# EAGLE schematic pic_k42 (EAGLE 9.6.2)
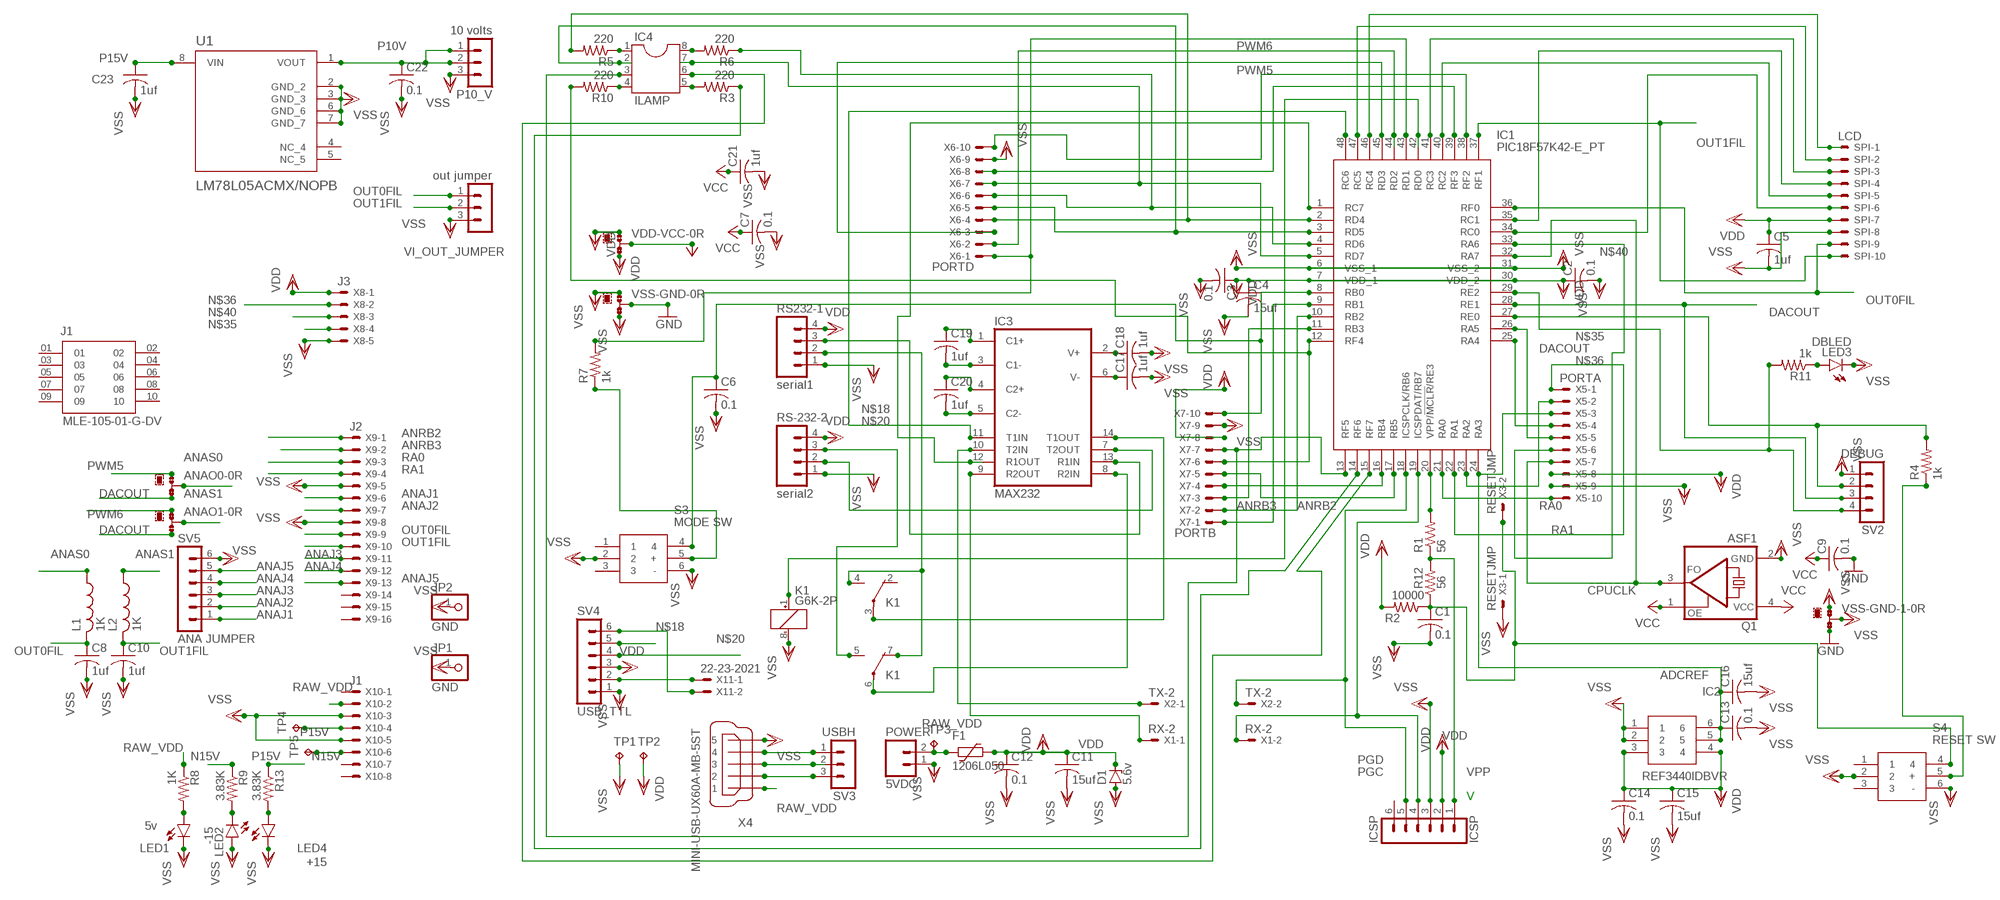
[diagram p0: schematic, sheet 1]

## Parts
ANAO0  PS V  0R-JUMPA  [A0R-JMP]
ANAO1  PS I  0R-JUMPA  [A0R-JMP]
C1  0.1  C-USC1206  [C1206]
C2  0.1  C-USC1206  [C1206]
C3  0.1  C-USC1206  [C1206]
C4  15uf  C-USC1206  [C1206]
C5  1uf  C-USC0805  [C0805]
C6  0.1  C-USC1206  [C1206]
C7  0.1  C-USC1206  [C1206]
C8  1uf  C-USC0805  [C0805]
C9  0.1  C-USC1206  [C1206]
C10  1uf  C-USC0805  [C0805]
C11  15uf  C-USC1206  [C1206]
C12  0.1  C-USC1206  [C1206]
C13  0.1  C-USC1206  [C1206]
C14  0.1  C-USC1206  [C1206]
C15  15uf  C-USC1206  [C1206]
C16  15uf  C-USC1206  [C1206]
C17  1uf  C-USC0805  [C0805]
C18  1uf  C-USC0805  [C0805]
C19  1uf  C-USC0805  [C0805]
C20  1uf  C-USC0805  [C0805]
C21  1uf  C-USC0805  [C0805]
C22  0.1  C-USC1206  [C1206]
C23  1uf  C-USC0805  [C0805]
D1  5.6v  ZENER-DIODEDO34-7  [DO34Z7]
F1  1206L050  [1206L]
IC1  PIC18F57K42-E_PT  [QFP50P900X900X120-48N]
IC2  REF3440IDBVR  [SOP95P280X145-6N]
IC3  MAX232  [DIL16]
IC4  ILAMP  DIL8S  [SOCKET-08]
ICSP  ICSP  MA06-1  [MA06-1]
J1  MLE-105-01-G-DV  [SAMTEC_MLE-105-01-G-DV]
JP1  GND  PINHD-1X1  [1X01]
JP2  GND  PINHD-1X1  [1X01]
K1  G6K-2P  [G6K-2P]
L1  1K  L-USL2012C  [L2012C]
L2  1K  L-USL2012C  [L2012C]
LED1  5v  LEDCHIPLED_1206  [CHIPLED_1206]
LED2  -15  LEDCHIPLED_1206  [CHIPLED_1206]
LED3  DBLED  LEDCHIPLED_1206  [CHIPLED_1206]
LED4  +15  LEDCHIPLED_1206  [CHIPLED_1206]
P10_V  10 volts  MA03-1  [MA03-1]
POWER  5VDC  M02  [02P]
Q1  ASF1  [ASF]
R1  56  R-US_R1206  [R1206]
R2  10000  R-US_R1206  [R1206]
R3  220  R-US_R1206  [R1206]
R4  1k  R-US_R1206  [R1206]
R5  220  R-US_R1206  [R1206]
R6  220  R-US_R1206  [R1206]
R7  1k  R-US_R1206  [R1206]
R8  1K  R-US_R1206  [R1206]
R9  3.83K  R-US_R1206  [R1206]
R10  220  R-US_R1206  [R1206]
R11  1k  R-US_R1206  [R1206]
R12  56  R-US_R1206  [R1206]
R13  3.83K  R-US_R1206  [R1206]
RS232-1  serial1  M04  [04P]
RS-232-2  serial2  M04  [04P]
S3  MODE SW  B3W-9000-Y1N  [B3W-9_1-LED]
S4  RESET SW  B3W-9000-Y1N  [B3W-9_1-LED]
SPI  LCD  22-23-2101  [22-23-2101]
SV2  DEBUG  MA04-1  [MA04-1]
SV3  USBH  MA03-1  [MA03-1]
SV4  USB_TTL  MA06-1  [MA06-1]
SV5  ANA JUMPER  MA06-1  [MA06-1]
TP1  TPB1,27  [B1,27]
TP2  TPB1,27  [B1,27]
TP3  TPB1,27  [B1,27]
TP4  TPB1,27  [B1,27]
TP5  TPB1,27  [B1,27]
U1  LM78L05ACMX/NOPB  [SOIC127P599X175-8N]
VDD-VCC  VDD-VCC  0R-JUMPA  [A0R-JMP]
VI_OUT_JUMPER  out jumper  MA03-1  [MA03-1]
VSS-GND  VSS-GND  0R-JUMPA  [A0R-JMP]
VSS-GND-1  0R-JUMPA  [A0R-JMP]
X1  RX-2  332-02  [332-02]
X2  TX-2  332-02  [332-02]
X3  RESETJMP  332-02  [332-02]
X4  MINI-USB-UX60A-MB-5ST  [UX60A-MB-5ST]
X5  PORTA  22-23-2101  [22-23-2101]
X6  PORTD  22-23-2101  [22-23-2101]
X7  PORTB  22-23-2101  [22-23-2101]
X8  J3  KK-156-5  [KK-156-5]
X9  J2  KK-156-16  [KK-156-16]
X10  J1  KK-156-8  [KK-156-8]
X11  22-23-2021  [22-23-2021]

## Nets
ADCREF: C13.1 C16.1 IC1.24(RA3) IC2.5 IC2.6 X5.3
ANAJ1: SV5.1 X9.6
ANAJ2: SV5.2 X9.7
ANAJ3: SV5.3 X9.11
ANAJ4: SV5.4 X9.12
ANAJ5: SV5.5 X9.13
ANAS0: ANAO0.2 L1.1
ANAS1: ANAO1.2 L2.1
ANRB2: IC1.10(RB2) X7.2 X9.1
ANRB3: IC1.11(RB3) X7.3 X9.2
CPUCLK: IC1.32(RA7) Q1.3(FO) X5.7
DACOUT: ANAO0.3 ANAO1.3 IC1.23(RA2) IC1.28(RE1) SV2.3 X5.2
GND: C9.2 VSS-GND-1.3 VSS-GND.2
N15V: R9.1 TP5.TP X10.6
N$2: IC1.20(VPP/!MCLR!/RE3) R1.2
N$3: IC4.1 R5.1
N$5: C17.1 IC3.6(V-)
N$9: C18.1 IC3.2(V+)
N$10: C19.1 IC3.1(C1+)
N$11: C20.1 IC3.4(C2+)
N$12: C20.2 IC3.5(C2-)
N$13: C19.2 IC3.3(C1-)
N$14: K1.4(2:S) K1.7(3:O) RS232-1.2
N$15: IC3.7(T2OUT) RS-232-2.2
N$16: IC3.13(R1IN) RS232-1.3
N$17: IC4.8 R6.2
N$18: IC1.1(RC7) IC3.12(R1OUT) SV4.5
N$19: IC3.9(R2OUT) X1.1
N$20: IC1.48(RC6) IC3.11(T1IN) SV4.4
N$21: R4.1 S4.5(+)
N$22: IC3.10(T2IN) X2.1
N$23: IC1.27(RE0) R4.2 SV2.2
N$25: IC1.29(RE2) R11.2 SV2.4
N$26: IC3.14(T1OUT) K1.3(2:P)
N$27: IC3.8(R2IN) K1.6(3:P)
N$28: IC1.42(RD0) K1.1(1:+)
N$29: IC1.46(RC4) SPI.1
N$30: IC1.47(RC5) SPI.2
N$31: IC1.41(RC3) SPI.3
N$32: IC1.35(RC1) SPI.4
N$33: IC1.40(RC2) SPI.5
N$34: IC1.34(RC0) SPI.6
N$35: IC1.26(RA5) X5.5 X8.4
N$36: IC1.25(RA4) X5.4 X8.2
N$40: IC1.33(RA6) X5.6 X8.3
N$43: C6.1 IC1.8(RB0) S3.4 X7.10
N$45: IC1.45(RD3) X6.3
N$46: IC1.2(RD4) R5.2 X6.4
N$47: IC1.3(RD5) IC4.2 X6.5
N$48: IC1.4(RD6) R6.1 X6.6
N$49: IC1.5(RD7) IC4.7 X6.7
N$51: IC1.39(RF3) X6.8
N$52: IC1.43(RD1) R7.2 X6.1
N$53: IC1.9(RB1) X7.1
N$55: IC4.5 R3.2
N$56: IC1.16(RB4) X7.4
N$57: IC1.17(RB5) X7.5
N$58: IC1.12(RF4) R10.2 X7.6
N$59: IC1.13(RF5) IC4.3 X7.7
N$60: IC1.15(RF7) IC4.6
N$61: IC1.14(RF6) R3.1
N$62: K1.5(3:S) RS-232-2.3
N$63: IC4.4 R10.1
N$64: R7.1 S3.5(+)
N$65: LED3.A R11.1
N$67: SV3.1 X4.4
N$68: SV3.2 X4.3
N$69: SV3.3 X4.2
N$70: C1.1 R2.1 R12.1 S4.4 X3.2
N$71: SV4.6 X11.2
N$72: SV4.2 X11.1
N$75: LED1.A R8.2
N$78: LED2.C R9.2
N$82: LED4.A R13.2
OUT0FIL: C8.1 IC1.36(RF0) L1.2 SPI.9 VI_OUT_JUMPER.1 X9.9
OUT1FIL: C10.1 IC1.37(RF1) L2.2 SPI.10 VI_OUT_JUMPER.2 X9.10
P10V: C22.1 P10_V.1 P10_V.2 U1.1(VOUT)
P15V: C23.1 R13.1 TP4.TP U1.8(VIN) X10.4
PGC: IC1.18(ICSPCLK/RB6) ICSP.5 X2.2
PGD: IC1.19(ICSPDAT/RB7) ICSP.4 X1.2
PWM5: ANAO0.1 IC1.38(RF2) X6.10
PWM6: ANAO1.1 IC1.44(RD2) X6.2
RA0: IC1.21(RA0) X5.10 X9.3
RA1: IC1.22(RA1) X5.1 X9.4
RAW_VDD [i-line]: F1.2 POWER.2 R8.1 TP3.TP X4.1 X10.2
VCC: C7.1 C9.1 C21.1 Q1.1(OE) Q1.4(VCC) VDD-VCC.2
VDD: C2.1 C3.1 C4.1 C5.1 C11.1 C12.1 C14.1 C15.1 D1.C F1.1 IC1.7(VDD_1) IC1.30(VDD_2) IC2.3 IC2.4 ICSP.2 R2.2 RS232-1.4 RS-232-2.4 SPI.7 SV4.3 TP2.TP VDD-VCC.1 VDD-VCC.3 X5.8 X7.8 X8.1
VPP: ICSP.1 R1.1 R12.2
VSS: C1.2 C2.2 C3.2 C4.2 C5.2 C6.2 C7.2 C8.2 C10.2 C11.2 C12.2 C13.2 C14.2 C15.2 C16.2 C17.2 C18.2 C21.2 C22.2 C23.2 D1.A IC1.6(VSS_1) IC1.31(VSS_2) IC2.1 IC2.2 ICSP.3 JP1.1 JP2.1 K1.8(1:-) LED1.C LED2.A LED3.C LED4.C P10_V.3 POWER.1 Q1.2(GND) RS232-1.1 RS-232-2.1 S3.2 S3.6(-) S4.2 S4.6(-) SPI.8 SV2.1 SV4.1 SV5.6 TP1.TP U1.2(GND_2) U1.3(GND_3) U1.6(GND_6) U1.7(GND_7) VI_OUT_JUMPER.3 VSS-GND-1.1 VSS-GND-1.2 VSS-GND.1 VSS-GND.3 X3.1 X4.5 X5.9 X6.9 X7.9 X8.5 X9.5 X9.8 X10.3 X10.5
Unconnected: ICSP.6 J1.01 J1.02 J1.03 J1.04 J1.05 J1.06 J1.07 J1.08 J1.09 J1.10 K1.2(2:O) S3.1 S3.3 S4.1 S4.3 X9.14 X9.15 X9.16 X10.1 X10.7 X10.8

## Notes on the sheet
- V

## Power pins joined to a net without a drawn wire
GND: IC3.15(GND)
NC_4: U1.4(NC_4)
NC_5: U1.5(NC_5)
VCC: IC3.16(VCC)

## Library data of the parts
ANAO0 ANAO1 VDD-VCC VSS-GND VSS-GND-1 = jump-0r-smd:0R-JUMP: SMD 0R 0805 Jumper
C1-C23 = rcl:C-US: CAPACITOR, American symbol; SPICEPREFIX: C
D1 = diode:ZENER-DIODE: Z-Diode
F1 = polyfuse-smd_10:?: Polyfuse Resettable PTC Source: http://www.littelfuse.com/products/resettable-ptcs.aspx; MF: Littelfuse; MPN: 1206L050; OC_FARNELL: 1596993; OC_NEWARK: 53M6118
IC1 = SamacSys_Parts:PIC18F57K42-E_PT: 8-bit Microcontrollers - MCU 128KB Flash, 8KB RAM, 256B EEPROM, 12-bit ADC2, Vector Interrupts, DMA, MAP, DIA, DAC, Comp, PWM, CWG, HLT, WWDT, SCAN/CRC, ZCD, PPS, EUSART, SPI/I2C, IDLE/DOZE/PMD Source: Datasheet <https://componentsearchengine.com/Datasheets/1/PIC18F57K42-E_PT.pdf>; DESCRIPTION: 8-bit Microcontrollers - MCU 128KB Flash, 8KB RAM, 256B EEPROM, 12-bit ADC2, Vector Interrupts, DMA, MAP, DIA, DAC, Comp, PWM, CWG, HLT, WWDT, SCAN/CRC, ZCD, PPS, EUSART, SPI/I2C, IDLE/DOZE/PMD; HEIGHT: 1.2mm; MANUFACTURER_NAME: Microchip; MANUFACTURER_PART_NUMBER: PIC18F57K42-E/PT; MOUSER_PART_NUMBER: 579-PIC18F57K42-E/PT
IC2 = SamacSys_Parts:REF3440IDBVR: 4.1V Low-Drift Low-Power Small-Footprint Series Voltage Reference Source: Datasheet <http://www.ti.com/lit/gpn/ref3440>; DESCRIPTION: 4.1V Low-Drift Low-Power Small-Footprint Series Voltage Reference; HEIGHT: 1.45mm; MANUFACTURER_NAME: Texas Instruments; MANUFACTURER_PART_NUMBER: REF3440IDBVR
IC3 = maxim:MAX232: RS232 TRANSCEIVER; MF: MAXIM; MPN: MAX232ACPE+; OC_FARNELL: 9723773; OC_NEWARK: 68K4544
IC4 = ic-package:DIL8: Dual In Line / Socket
ICSP SV4 SV5 = con-lstb:MA06-1: PIN HEADER; OC_FARNELL: unknown; OC_NEWARK: unknown
J1 = MLE-105-01-G-DV:MLE-105-01-G-DV; MANUFACTURER: SAMTEC
JP1 JP2 = pinhead:PINHD-1X1: PIN HEADER
K1 = relay:G6K: Low Signal Relay oeiwcsnts1.omron.com/.. D20G6K0100.pdf; MF: OMRON COMPONENTS USA; MPN: G6K-2P DC3; OC_FARNELL: 3937276; OC_NEWARK: 89C6482
L1 L2 = rcl:L-US: INDUCTOR, American symbol; SPICEPREFIX: L
LED1-LED4 = led:LED: LED OSRAM: - CHIPLED LG R971, LG N971, LY N971, LG Q971, LY Q971, LO R971, LY R971 LH N974, LH R974 LS Q976, LO Q976, LY Q976 LO Q996 - Hyper CHIPLED LW Q18S LB Q993, LB Q99A, LB R99A - SideLED LS A670, LO A670, LY A670, LG A670, LP A670 LB A673, LV A673, LT A673, LW A673 LH A674 LY A675 LS A676, LA A676, LO A676, LY A676, LW A676 LS A679, LY A679, LG A679 - Hyper Micro SIDELED® LS Y876, LA Y876, LO Y876, LY Y876 LT Y87S - SmartLED LW L88C, LW L88S LB L89C, LB L89S, LG L890 LS L89K, LO L89K, LY L89K LS L896, LA L896, LO L896, LY L896 - TOPLED LS T670, LO T670, LY T670, LG T670, LP T670 LSG T670, LSP T670, LSY T670, LOP T670, LYG T670 LG T671, LOG T671, LSG T671 LB T673, LV T673, LT T673, LW T673 LH T674 LS T676, LA T676, LO T676, LY T676, LB T676, LH T676, LSB T676, LW T676 LB T67C, LV T67C, LT T67C, LS T67K, LO T67K, LY T67K, LW E67C LS E67B, LA E67B, LO E67B, LY E67B, LB E67C, LV E67C, LT E67C LW T67C LS T679, LY T679, LG T679 LS T770, LO T770, LY T770, LG T770, LP T770 LB T773, LV T773, LT T773, LW T773 LH T774 LS E675, LA E675, LY E675, LS T675 LS T776, LA T776, LO T776, LY T776, LB T776 LHGB T686 LT T68C, LB T68C - Hyper Mini TOPLED® LB M676 - Mini TOPLED Santana® LG M470 LS M47K, LO M47K, LY M47K Source: http://www.osram.convergy.de LUXEON: - LUMILED® LXK2-PW12-R00, LXK2-PW12-S00, LXK2-PW14-U00, LXK2-PW14-V00 LXK2-PM12-R00, LXK2-PM12-S00, LXK2-PM14-U00 LXK2-PE12-Q00, LXK2-PE12-R00, LXK2-PE12-S00, LXK2-PE14-T00, LXK2-PE14-U00 LXK2-PB12-K00, LXK2-PB12-L00, LXK2-PB12-M00, LXK2-PB14-N00, LXK2-PB14-P00, LXK2-PB14-Q00 LXK2-PR12-L00, LXK2-PR12-M00, LXK2-PR14-Q00, LXK2-PR14-R00 LXK2-PD12-Q00, LXK2-PD12-R00, LXK2-PD12-S00 LXK2-PH12-R00, LXK2-PH12-S00 LXK2-PL12-P00, LXK2-PL12-Q00, LXK2-PL12-R00 Source: www.luxeon.com KINGBRIGHT: KA-3528ASYC Source: www.kingbright.com
P10_V SV3 VI_OUT_JUMPER = con-lstb:MA03-1: PIN HEADER; OC_FARNELL: unknown; OC_NEWARK: unknown
POWER = con-amp-quick:M02: AMP QUICK CONNECTOR; OC_FARNELL: unknown; OC_NEWARK: unknown
Q1 = crystal:ASF*: CRYSTAL CLOCK OSCILLATORS 5.0 Vdc or 3.3 Vdc - LOW PROFILE ULTRA MINIATURE CERAMIC SURFACE MOUNT Source: http://www.abracon.com/Oscillators/asf1-L-L1.pdf; OC_FARNELL: unknown; OC_NEWARK: unknown
R1-R13 = rcl:R-US_: RESISTOR, American symbol; SPICEPREFIX: R
RS232-1 RS-232-2 = con-amp-quick:M04: AMP QUICK CONNECTOR; OC_FARNELL: unknown; OC_NEWARK: unknown
S3 S4 = SamacSys_Parts:B3W-9000-Y1N: Illuminated Tactile Switches Illuminated Ylw LED White Cap Source: Datasheet <http://www.mouser.com/ds/2/307/en-b3w-9-11824.pdf>; ALLIED_NUMBER: 70176005; ALLIED_PRICE-STOCK: https://www.alliedelec.com/omron-electronic-components-b3w-9000-y1n/70176005/; DESCRIPTION: Illuminated Tactile Switches Illuminated Ylw LED White Cap; HEIGHT: mm; MANUFACTURER_NAME: Omron Electronics; MANUFACTURER_PART_NUMBER: B3W-9000-Y1N; MOUSER_PART_NUMBER: 653-B3W-9000-Y1N; MOUSER_PRICE-STOCK: https://www.mouser.com/Search/Refine.aspx?Keyword=653-B3W-9000-Y1N; RS_PART_NUMBER: 0492777P; RS_PRICE-STOCK: http://uk.rs-online.com/web/p/products/0492777P
SPI X5-X7 = con-molex:22-23-2101: .100" (2.54mm) Center Header - 10 Pin; MF: MOLEX; MPN: 22-23-2101; OC_FARNELL: 1756828; OC_NEWARK: 94C0765
SV2 = con-lstb:MA04-1: PIN HEADER; OC_FARNELL: unknown; OC_NEWARK: unknown
TP1-TP5 = testpad:TP: Test pad
U1 = LM78L05ACMX_NOPB:LM78L05ACMX/NOPB: 100-mA, 30-V, linear voltage regulator 8-SOIC 0 to 125 Check availability <https://pricing.snapeda.com/parts/LM78L05ACMX/NOPB/Texas%20Instruments/view-part?ref=eda>; AVAILABILITY: In Stock; DESCRIPTION: 100-mA, 30-V, linear voltage regulator 8-SOIC 0 to 125; MF: Texas Instruments; MP: LM78L05ACMX/NOPB; PACKAGE: SOIC-8 Texas Instruments; PRICE: None; PURCHASE-URL: https://pricing.snapeda.com/search/part/LM78L05ACMX/NOPB/?ref=eda
X1-X3 = con-garry:332-02: 2 Pin - 2mm Dual Row Source: www.mpe-connector.de / garry_shortform_2012.pdf
X4 = con-hirose:MINI-USB-: MINI USB Connector Source: http://www.hirose.co.jp/cataloge_hp/e24000019.pdf; OC_FARNELL: unknown; OC_NEWARK: unknown
X8 = con-molex:KK-156-5: KK 156 HEADER Source: http://www.molex.com/pdm_docs/sd/026604100_sd.pdf; MF: MOLEX; OC_FARNELL: unknown; OC_NEWARK: unknown
X9 = con-molex:KK-156-16: KK 156 HEADER Source: http://www.molex.com/pdm_docs/sd/026604100_sd.pdf; MF: MOLEX; OC_FARNELL: unknown; OC_NEWARK: unknown
X10 = con-molex:KK-156-8: KK 156 HEADER Source: http://www.molex.com/pdm_docs/sd/026604100_sd.pdf; MF: MOLEX; OC_FARNELL: unknown; OC_NEWARK: unknown
X11 = con-molex:22-23-2021: .100" (2.54mm) Center Header - 2 Pin; MF: MOLEX; MPN: 22-23-2021; OC_FARNELL: 1462926; OC_NEWARK: 25C3832

## Net classes
1 i-line: width 0.3 mm